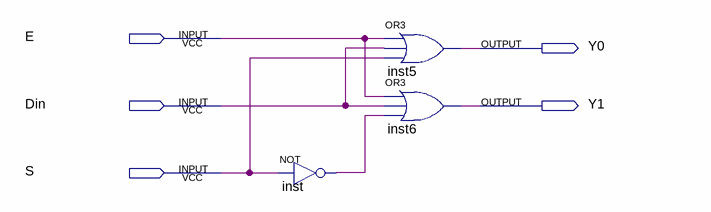
[diagram p0: schematic sheet]
// Quartus schematic DMux.bdf as structural Verilog: 3 symbols, 5 pins
module DMux (
  input  E,
  input  Din,
  input  S,
  output Y0,
  output Y1
);

  wire inst_out;

  not inst (inst_out, S);
  or inst5 (Y0, E, Din, S);
  or inst6 (Y1, E, Din, inst_out);
endmodule
